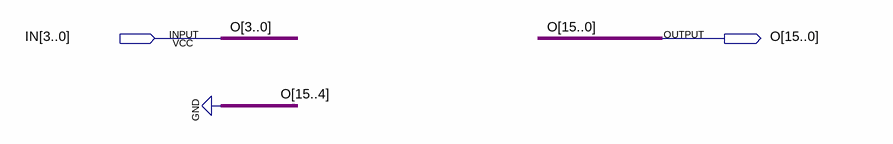
[diagram p0: schematic sheet]
// Quartus schematic SE.bdf as structural Verilog: 0 symbols, 2 pins
module SE (
  input  [3:0] IN,
  output [15:0] O
);


  assign O = {{12{1'b0}}, IN};
endmodule
